# Altium schematic sheet LightStrip.SchDoc: Light Strip Peripheral
size A4; DrawnBy: J.F.B.; Revision: 1; SheetNumber: 1; SheetTotal: 1
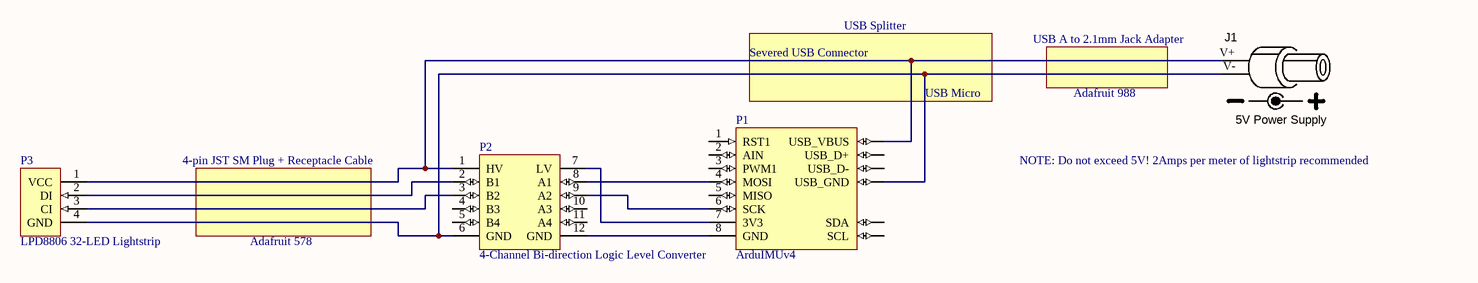
[diagram p0: LightStrip.SchDoc]

## Parts
J1  Supplier Part Number 1: 5V Power Supply  [HDR_1x2_Power]  (hidden comment: 2.1mm ID; 5.5mm OD; Locking Type)
P1  ArduIMUv4
P2  4-Channel Bi-direction Logic Level Converter
P3  LPD8806 32-LED Lightstrip

## Nets
NetJ1_V+: J1.V+ P1.9(USB_VBUS) P2.1(HV) P3.1(VCC)
NetJ1_V-: J1.V- P1.12(USB_GND) P2.6(GND) P3.4(GND)
NetP1_4: P1.4(MOSI) P2.8(A1)
NetP1_6: P1.6(SCK) P2.9(A2)
NetP1_7: P1.7(3V3) P2.7(LV)
NetP1_8: P1.8(GND) P2.12(GND)
NetP2_2: P2.2(B1) P3.2(DI)
NetP2_3: P2.3(B2) P3.3(CI)

Not connected (* = marked no-connect by the designer): P1 1(RST1) 2(AIN) 3(PWM1) 5(MISO) 10(USB_D+) 11(USB_D-) 13(SDA) 14(SCL); P2 4(B3) 5(B4) 10(A3) 11(A4)

## Notes on the sheet
- Severed USB Connector
- USB Splitter
- (near J1) USB A to 2.1mm Jack Adapter
- USB Micro
- Adafruit 988
- 4-pin JST SM Plug + Receptacle Cable
- NOTE: Do not exceed 5V! 2Amps per meter of lightstrip recommended
- Adafruit 578

## Library data of the parts
J1 = CONN_PWR_PLUG_2.1x5.5mm: Power Plug Locking Type 2.1mm ID x 5.5mm OD; Manufacturer 1: Tensility International Corp; Manufacturer Part Number 1: 10-00109; QtyOverride: 0.5; Ratings: 12VDC @ 5A; SCDType: undef; Category: Connectors; Mounting Type: Through Hole; Package / Case: Flying Leads; Value: 2.1mm ID; 5.5mm OD; Locking Type; Supplier 1: Digi-Key
P1 = ArduIMUv4: ArduIMU v4